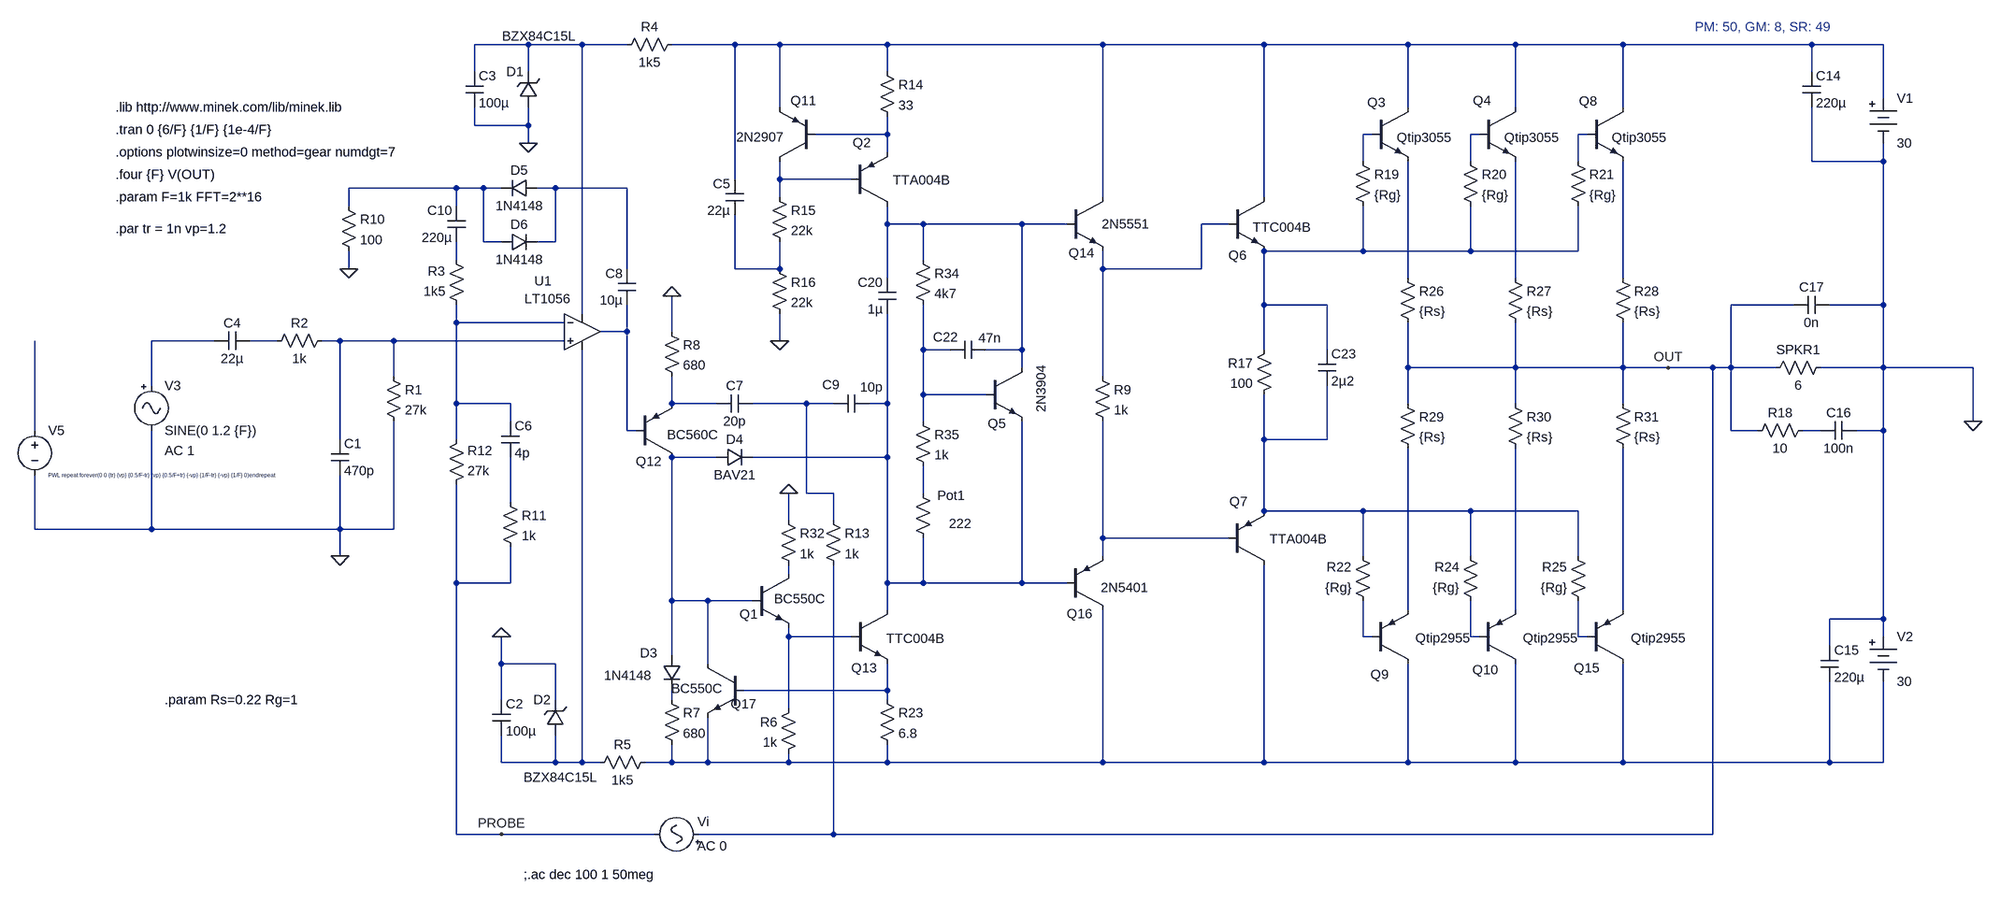
[diagram p0: schematic b44.3055.triple.5.steve.Jun11.asc]
b44.3055.triple.5.steve.Jun11.asc, the LTspice schematic file:
Version 4
SHEET 1 2228 840
WIRE -1952 -880 -2048 -880
WIRE -1856 -880 -1952 -880
WIRE -1776 -880 -1856 -880
WIRE -1584 -880 -1696 -880
WIRE -1504 -880 -1584 -880
WIRE -1312 -880 -1504 -880
WIRE -928 -880 -1312 -880
WIRE -640 -880 -928 -880
WIRE -384 -880 -640 -880
WIRE -192 -880 -384 -880
WIRE 0 -880 -192 -880
WIRE 336 -880 0 -880
WIRE 464 -880 336 -880
WIRE -2048 -832 -2048 -880
WIRE -1952 -832 -1952 -880
WIRE -1312 -832 -1312 -880
WIRE 336 -832 336 -880
WIRE 464 -784 464 -880
WIRE -1504 -768 -1504 -880
WIRE -384 -768 -384 -880
WIRE -192 -768 -192 -880
WIRE 0 -768 0 -880
WIRE -2048 -736 -2048 -768
WIRE -1952 -736 -1952 -768
WIRE -1952 -736 -2048 -736
WIRE -1312 -720 -1312 -752
WIRE -1312 -720 -1440 -720
WIRE -448 -720 -464 -720
WIRE -256 -720 -272 -720
WIRE -64 -720 -80 -720
WIRE -1952 -704 -1952 -736
WIRE -1312 -688 -1312 -720
WIRE -464 -672 -464 -720
WIRE -272 -672 -272 -720
WIRE -80 -672 -80 -720
WIRE 336 -672 336 -768
WIRE 464 -672 464 -704
WIRE 464 -672 336 -672
WIRE -1584 -640 -1584 -880
WIRE -1504 -640 -1504 -672
WIRE -1376 -640 -1504 -640
WIRE -2080 -624 -2272 -624
WIRE -2032 -624 -2080 -624
WIRE -2000 -624 -2032 -624
WIRE -1904 -624 -1936 -624
WIRE -1776 -624 -1904 -624
WIRE -1504 -608 -1504 -640
WIRE -928 -608 -928 -880
WIRE -640 -608 -640 -880
WIRE -2272 -592 -2272 -624
WIRE -2080 -592 -2080 -624
WIRE -1312 -560 -1312 -592
WIRE -1248 -560 -1312 -560
WIRE -1072 -560 -1248 -560
WIRE -992 -560 -1072 -560
WIRE -704 -560 -752 -560
WIRE -2032 -528 -2032 -624
WIRE -2000 -528 -2032 -528
WIRE -1904 -528 -1904 -624
WIRE -1904 -528 -1936 -528
WIRE -464 -512 -464 -592
WIRE -464 -512 -640 -512
WIRE -272 -512 -272 -592
WIRE -272 -512 -464 -512
WIRE -80 -512 -80 -592
WIRE -80 -512 -272 -512
WIRE -2080 -496 -2080 -528
WIRE -1248 -496 -1248 -560
WIRE -2272 -480 -2272 -512
WIRE -1776 -480 -1776 -624
WIRE -1584 -480 -1584 -576
WIRE -1504 -480 -1504 -528
WIRE -1504 -480 -1584 -480
WIRE -928 -480 -928 -512
WIRE -752 -480 -752 -560
WIRE -752 -480 -928 -480
WIRE -1312 -464 -1312 -560
WIRE -384 -464 -384 -672
WIRE -192 -464 -192 -672
WIRE 0 -464 0 -672
WIRE -640 -416 -640 -512
WIRE -528 -416 -640 -416
WIRE 304 -416 192 -416
WIRE 464 -416 464 -672
WIRE 464 -416 368 -416
WIRE -1856 -400 -1856 -880
WIRE -2080 -384 -2080 -416
WIRE -1888 -384 -2080 -384
WIRE -1776 -368 -1776 -416
WIRE -1776 -368 -1824 -368
WIRE -1696 -368 -1696 -432
WIRE -2512 -352 -2624 -352
WIRE -2400 -352 -2448 -352
WIRE -2288 -352 -2320 -352
WIRE -2192 -352 -2288 -352
WIRE -1888 -352 -2192 -352
WIRE -1504 -352 -1504 -400
WIRE -1248 -336 -1248 -416
WIRE -1200 -336 -1248 -336
WIRE -1072 -336 -1072 -560
WIRE -1072 -336 -1136 -336
WIRE -640 -336 -640 -416
WIRE -528 -336 -528 -416
WIRE -1072 -304 -1072 -336
WIRE -384 -304 -384 -384
WIRE -192 -304 -192 -384
WIRE -192 -304 -384 -304
WIRE 0 -304 0 -384
WIRE 0 -304 -192 -304
WIRE 80 -304 0 -304
WIRE 160 -304 80 -304
WIRE 192 -304 192 -416
WIRE 192 -304 160 -304
WIRE 272 -304 192 -304
WIRE 464 -304 464 -416
WIRE 464 -304 352 -304
WIRE 624 -304 464 -304
WIRE -2192 -288 -2192 -352
WIRE -928 -288 -928 -480
WIRE -2624 -272 -2624 -352
WIRE -1248 -256 -1248 -336
WIRE -1136 -256 -1248 -256
WIRE -2080 -240 -2080 -384
WIRE -1984 -240 -2080 -240
WIRE -1696 -240 -1696 -288
WIRE -1616 -240 -1696 -240
WIRE -1456 -240 -1552 -240
WIRE -1408 -240 -1456 -240
WIRE -1312 -240 -1312 -400
WIRE -1312 -240 -1344 -240
WIRE -384 -240 -384 -304
WIRE -192 -240 -192 -304
WIRE 0 -240 0 -304
WIRE -1984 -208 -1984 -240
WIRE -1248 -208 -1248 -256
WIRE 624 -208 624 -304
WIRE -2832 -192 -2832 -352
WIRE -1776 -192 -1776 -368
WIRE -1760 -192 -1776 -192
WIRE 192 -192 192 -304
WIRE 240 -192 192 -192
WIRE 352 -192 320 -192
WIRE 464 -192 464 -304
WIRE 464 -192 416 -192
WIRE -2288 -176 -2288 -352
WIRE -2080 -176 -2080 -240
WIRE -640 -176 -640 -256
WIRE -528 -176 -528 -272
WIRE -528 -176 -640 -176
WIRE -1616 -144 -1696 -144
WIRE -1312 -144 -1312 -240
WIRE -1312 -144 -1552 -144
WIRE -1456 -80 -1456 -240
WIRE -1408 -80 -1456 -80
WIRE -1248 -80 -1248 -128
WIRE -1984 -64 -1984 -144
WIRE -640 -48 -640 -176
WIRE -464 -48 -640 -48
WIRE -272 -48 -464 -48
WIRE -80 -48 -272 -48
WIRE -1488 -32 -1488 -80
WIRE -1408 -32 -1408 -80
WIRE -2832 -16 -2832 -112
WIRE -2624 -16 -2624 -192
WIRE -2624 -16 -2832 -16
WIRE -2288 -16 -2288 -112
WIRE -2288 -16 -2624 -16
WIRE -2192 -16 -2192 -208
WIRE -2192 -16 -2288 -16
WIRE -928 0 -928 -208
WIRE -704 0 -928 0
WIRE -2288 32 -2288 -16
WIRE -928 32 -928 0
WIRE -464 32 -464 -48
WIRE -272 32 -272 -48
WIRE -80 32 -80 -48
WIRE -1488 64 -1488 48
WIRE -2080 80 -2080 -96
WIRE -1984 80 -1984 16
WIRE -1984 80 -2080 80
WIRE -1312 80 -1312 -144
WIRE -1248 80 -1248 0
WIRE -1248 80 -1312 80
WIRE -1072 80 -1072 -208
WIRE -1072 80 -1248 80
WIRE -992 80 -1072 80
WIRE -1696 112 -1696 -144
WIRE -1632 112 -1696 112
WIRE -1552 112 -1632 112
WIRE -1312 128 -1312 80
WIRE -384 128 -384 -160
WIRE -192 128 -192 -160
WIRE 0 128 0 -160
WIRE 464 144 464 -192
WIRE 464 144 368 144
WIRE -1488 176 -1488 160
WIRE -1376 176 -1488 176
WIRE -464 176 -464 112
WIRE -448 176 -464 176
WIRE -272 176 -272 112
WIRE -256 176 -272 176
WIRE -80 176 -80 112
WIRE -64 176 -80 176
WIRE 464 176 464 144
WIRE 368 192 368 144
WIRE -1696 208 -1696 112
WIRE -2000 224 -2000 176
WIRE -1904 224 -2000 224
WIRE -1632 224 -1632 112
WIRE -1312 272 -1312 224
WIRE -1312 272 -1568 272
WIRE -2000 288 -2000 224
WIRE -1904 288 -1904 224
WIRE -1696 288 -1696 272
WIRE -1312 288 -1312 272
WIRE -1488 304 -1488 176
WIRE -2000 400 -2000 352
WIRE -1904 400 -1904 352
WIRE -1904 400 -2000 400
WIRE -1856 400 -1856 -336
WIRE -1856 400 -1904 400
WIRE -1824 400 -1856 400
WIRE -1696 400 -1696 368
WIRE -1696 400 -1744 400
WIRE -1632 400 -1632 320
WIRE -1632 400 -1696 400
WIRE -1488 400 -1488 384
WIRE -1488 400 -1632 400
WIRE -1312 400 -1312 368
WIRE -1312 400 -1488 400
WIRE -928 400 -928 128
WIRE -928 400 -1312 400
WIRE -640 400 -640 48
WIRE -640 400 -928 400
WIRE -384 400 -384 224
WIRE -384 400 -640 400
WIRE -192 400 -192 224
WIRE -192 400 -384 400
WIRE 0 400 0 224
WIRE 0 400 -192 400
WIRE 368 400 368 256
WIRE 368 400 0 400
WIRE 464 400 464 256
WIRE 464 400 368 400
WIRE -2080 528 -2080 80
WIRE -2000 528 -2080 528
WIRE -1728 528 -2000 528
WIRE -1408 528 -1408 48
WIRE -1408 528 -1648 528
WIRE 160 528 160 -304
WIRE 160 528 -1408 528
FLAG 624 -208 0
FLAG 80 -304 OUT
FLAG -2000 528 PROBE
FLAG -2288 32 0
FLAG -2000 176 0
FLAG -1952 -704 0
FLAG -1696 -432 0
FLAG -1504 -352 0
FLAG -1488 -80 0
FLAG -2272 -480 0
SYMBOL res -624 -352 M0
SYMATTR InstName R17
SYMATTR Value 100
SYMATTR SpiceLine pwr=0.5
SYMBOL Misc\\battery 464 -800 R0
WINDOW 123 0 0 Left 2
WINDOW 39 0 0 Left 2
SYMATTR InstName V1
SYMATTR Value 30
SYMBOL Misc\\battery 464 160 R0
WINDOW 123 0 0 Left 2
WINDOW 39 0 0 Left 2
SYMATTR InstName V2
SYMATTR Value 30
SYMBOL res 368 -320 R90
WINDOW 0 0 56 VBottom 2
WINDOW 3 32 56 VTop 2
SYMATTR InstName SPKR1
SYMATTR Value 6
SYMBOL cap 320 -832 R0
SYMATTR InstName C14
SYMATTR Value 220µ
SYMATTR SpiceLine V=63
SYMBOL cap 352 192 R0
SYMATTR InstName C15
SYMATTR Value 220µ
SYMATTR SpiceLine V=63
SYMBOL res 224 -176 R270
WINDOW 0 32 56 VTop 2
WINDOW 3 0 56 VBottom 2
SYMATTR InstName R18
SYMATTR Value 10
SYMATTR SpiceLine pwr=2
SYMBOL cap 352 -176 R270
WINDOW 0 32 32 VTop 2
WINDOW 3 0 32 VBottom 2
SYMATTR InstName C16
SYMATTR Value 100n
SYMATTR SpiceLine V=200
SYMBOL res -480 -688 R0
SYMATTR InstName R19
SYMATTR Value {Rg}
SYMBOL res -288 -688 R0
SYMATTR InstName R20
SYMATTR Value {Rg}
SYMBOL res -96 -688 R0
SYMATTR InstName R21
SYMATTR Value {Rg}
SYMBOL res -448 128 R180
WINDOW 0 36 76 Left 2
WINDOW 3 36 40 Left 2
SYMATTR InstName R22
SYMATTR Value {Rg}
SYMBOL res -256 128 R180
WINDOW 0 36 76 Left 2
WINDOW 3 36 40 Left 2
SYMATTR InstName R24
SYMATTR Value {Rg}
SYMBOL res -64 128 R180
WINDOW 0 36 76 Left 2
WINDOW 3 36 40 Left 2
SYMATTR InstName R25
SYMATTR Value {Rg}
SYMBOL res -400 -480 R0
SYMATTR InstName R26
SYMATTR Value {Rs}
SYMATTR SpiceLine pwr=2
SYMBOL res -208 -480 R0
SYMATTR InstName R27
SYMATTR Value {Rs}
SYMATTR SpiceLine pwr=2
SYMBOL res -16 -480 R0
SYMATTR InstName R28
SYMATTR Value {Rs}
SYMATTR SpiceLine pwr=2
SYMBOL cap 304 -400 R270
WINDOW 0 32 32 VTop 2
WINDOW 3 0 32 VBottom 2
SYMATTR InstName C17
SYMATTR Value 0n
SYMBOL res -400 -256 R0
SYMATTR InstName R29
SYMATTR Value {Rs}
SYMATTR SpiceLine pwr=2
SYMBOL res -208 -256 R0
SYMATTR InstName R30
SYMATTR Value {Rs}
SYMATTR SpiceLine pwr=2
SYMBOL res -16 -256 R0
SYMATTR InstName R31
SYMATTR Value {Rs}
SYMATTR SpiceLine pwr=2
SYMBOL Misc\\signal -1632 528 M270
WINDOW 123 -21 19 VLeft 2
WINDOW 3 24 104 Invisible 2
WINDOW 0 22 18 VLeft 2
WINDOW 39 0 0 Left 0
SYMATTR Value2 AC 0
SYMATTR Value 0
SYMATTR InstName Vi
SYMBOL res -1264 -512 R0
SYMATTR InstName R34
SYMATTR Value 4k7
SYMBOL res -1264 -96 R0
WINDOW 0 41 20 Left 2
WINDOW 3 62 70 Left 2
SYMATTR InstName Pot1
SYMATTR Value 222
SYMBOL res -1264 -224 R0
SYMATTR InstName R35
SYMATTR Value 1k
SYMBOL npn -1136 -304 R0
WINDOW 0 3 100 Left 2
WINDOW 3 99 -4 VRight 2
SYMATTR InstName Q5
SYMATTR Value 2N3904
SYMBOL npn -704 -608 R0
WINDOW 0 0 104 Left 2
WINDOW 3 44 54 Left 2
SYMATTR InstName Q6
SYMATTR Value TTC004B
SYMBOL pnp -704 48 M180
WINDOW 0 2 113 Left 2
WINDOW 3 176 46 Right 2
SYMATTR InstName Q7
SYMATTR Value TTA004B
SYMBOL cap -1200 -320 R270
WINDOW 0 23 -8 VTop 2
WINDOW 3 52 71 VBottom 2
SYMATTR InstName C22
SYMATTR Value 47n
SYMBOL cap -544 -336 R0
SYMATTR InstName C23
SYMATTR Value 2µ2
SYMATTR SpiceLine V=100
SYMBOL cap -1296 -464 M0
SYMATTR InstName C20
SYMATTR Value 1µ
SYMATTR SpiceLine V=100
SYMBOL npn -448 -768 R0
WINDOW 0 -8 -9 Left 2
WINDOW 3 44 54 Left 2
SYMATTR InstName Q3
SYMATTR Value Qtip3055
SYMBOL npn -256 -768 R0
WINDOW 0 -12 -12 Left 2
WINDOW 3 44 54 Left 2
SYMATTR InstName Q4
SYMATTR Value Qtip3055
SYMBOL npn -64 -768 R0
WINDOW 0 -15 -11 Left 2
WINDOW 3 44 54 Left 2
SYMATTR InstName Q8
SYMATTR Value Qtip3055
SYMBOL pnp -448 224 M180
WINDOW 0 -2 -19 Left 2
WINDOW 3 176 46 Right 2
SYMATTR InstName Q9
SYMATTR Value Qtip2955
SYMBOL pnp -256 224 M180
WINDOW 0 -13 -11 Left 2
WINDOW 3 176 46 Right 2
SYMATTR InstName Q10
SYMATTR Value Qtip2955
SYMBOL pnp -64 224 M180
WINDOW 0 -24 -8 Left 2
WINDOW 3 176 46 Right 2
SYMATTR InstName Q15
SYMATTR Value Qtip2955
SYMBOL res -2208 -304 R0
SYMATTR InstName R1
SYMATTR Value 27k
SYMBOL cap -2304 -176 R0
SYMATTR InstName C1
SYMATTR Value 470p
SYMBOL res -2304 -368 R90
WINDOW 0 0 56 VBottom 2
WINDOW 3 32 56 VTop 2
SYMATTR InstName R2
SYMATTR Value 1k
SYMBOL Misc\\signal -2624 -288 R0
WINDOW 123 24 132 Left 2
WINDOW 39 0 0 Left 0
SYMATTR Value2 AC 1
SYMATTR InstName V3
SYMATTR Value SINE(0 1.2 {F})
SYMBOL Opamps\\LT1056 -1856 -432 R0
WINDOW 0 -85 -26 Left 2
WINDOW 3 -103 5 Left 2
SYMATTR InstName U1
SYMBOL res -2064 -400 R180
WINDOW 0 36 76 Left 2
WINDOW 3 36 40 Left 2
SYMATTR InstName R3
SYMATTR Value 1k5
SYMBOL res -1680 -896 R90
WINDOW 0 0 56 VBottom 2
WINDOW 3 32 56 VTop 2
SYMATTR InstName R4
SYMATTR Value 1k5
SYMATTR SpiceLine pwr=0.5
SYMBOL res -1728 384 R90
WINDOW 0 0 56 VBottom 2
WINDOW 3 32 56 VTop 2
SYMATTR InstName R5
SYMATTR Value 1k5
SYMATTR SpiceLine pwr=0.5
SYMBOL cap -2016 288 R0
SYMATTR InstName C2
SYMATTR Value 100µ
SYMATTR SpiceLine V=25
SYMBOL cap -2064 -832 R0
SYMATTR InstName C3
SYMATTR Value 100µ
SYMATTR SpiceLine V=25
SYMBOL zener -1936 -768 R180
WINDOW 0 24 64 Left 2
WINDOW 3 -69 127 Left 2
SYMATTR InstName D1
SYMATTR Value BZX84C15L
SYMATTR Description Diode
SYMATTR Type diode
SYMBOL zener -1888 352 R180
WINDOW 0 24 64 Left 2
WINDOW 3 -59 -75 Left 2
SYMATTR InstName D2
SYMATTR Value BZX84C15L
SYMATTR Description Diode
SYMATTR Type diode
SYMBOL res -1472 288 M0
SYMATTR InstName R6
SYMATTR Value 1k
SYMBOL res -1712 272 R0
SYMATTR InstName R7
SYMATTR Value 680
SYMBOL npn -1552 64 R0
WINDOW 0 -23 72 Left 2
WINDOW 3 38 44 Left 2
SYMATTR InstName Q1
SYMATTR Value BC550C
SYMBOL cap -2448 -368 R90
WINDOW 0 0 32 VBottom 2
WINDOW 3 32 32 VTop 2
SYMATTR InstName C4
SYMATTR Value 22µ
SYMBOL res -1712 -384 R0
SYMATTR InstName R8
SYMATTR Value 680
SYMBOL diode -1712 208 R0
WINDOW 0 -41 -3 Left 2
WINDOW 3 -105 37 Left 2
SYMATTR InstName D3
SYMATTR Value 1N4148
SYMBOL res -2096 -80 M180
WINDOW 0 36 76 Left 2
WINDOW 3 36 40 Left 2
SYMATTR InstName R12
SYMATTR Value 27k
SYMBOL res -1424 -48 R0
SYMATTR InstName R13
SYMATTR Value 1k
SYMBOL pnp -1440 -672 R180
WINDOW 0 -1 108 Left 2
WINDOW 3 141 43 Right 2
SYMATTR InstName Q11
SYMATTR Value 2N2907
SYMBOL res -1328 -848 R0
SYMATTR InstName R14
SYMATTR Value 33
SYMBOL res -1520 -624 R0
SYMATTR InstName R15
SYMATTR Value 22k
SYMBOL res -1520 -496 R0
SYMATTR InstName R16
SYMATTR Value 22k
SYMBOL cap -1568 -640 M0
SYMATTR InstName C5
SYMATTR Value 22µ
SYMATTR SpiceLine V=25
SYMBOL cap -2000 -144 M180
WINDOW 0 24 56 Left 2
WINDOW 3 24 8 Left 2
SYMATTR InstName C6
SYMATTR Value 4p
SYMBOL pnp -1760 -144 M180
WINDOW 0 0 -7 Left 2
WINDOW 3 146 40 Right 2
SYMATTR InstName Q12
SYMATTR Value BC560C
SYMBOL res -1328 272 R0
SYMATTR InstName R23
SYMATTR Value 6.8
SYMBOL cap -1552 -256 R90
WINDOW 0 0 32 VBottom 2
WINDOW 3 32 32 VTop 2
SYMATTR InstName C7
SYMATTR Value 20p
SYMBOL cap -1344 -256 R90
WINDOW 0 -2 68 VBottom 2
WINDOW 3 -29 -4 VTop 2
SYMATTR InstName C9
SYMATTR Value 10p
SYMBOL diode -1616 -128 R270
WINDOW 0 32 32 VTop 2
WINDOW 3 0 32 VBottom 2
SYMATTR InstName D4
SYMATTR Value BAV21
SYMBOL cap -2064 -528 R180
WINDOW 0 24 56 Left 2
WINDOW 3 24 8 Left 2
SYMATTR InstName C10
SYMATTR Value 220µ
SYMBOL pnp -1376 -592 M180
WINDOW 0 2 113 Left 2
WINDOW 3 176 46 Right 2
SYMATTR InstName Q2
SYMATTR Value TTA004B
SYMBOL npn -1376 128 R0
WINDOW 0 0 104 Left 2
WINDOW 3 62 51 Left 2
SYMATTR InstName Q13
SYMATTR Value TTC004B
SYMBOL npn -992 -608 R0
WINDOW 0 3 100 Left 2
WINDOW 3 147 48 Right 2
SYMATTR InstName Q14
SYMATTR Value 2N5551
SYMBOL pnp -992 128 M180
WINDOW 0 0 -7 Left 2
WINDOW 3 146 40 Right 2
SYMATTR InstName Q16
SYMATTR Value 2N5401
SYMBOL res -944 -304 R0
SYMATTR InstName R9
SYMATTR Value 1k
SYMBOL diode -1936 -640 R90
WINDOW 0 0 32 VBottom 2
WINDOW 3 32 32 VTop 2
SYMATTR InstName D5
SYMATTR Value 1N4148
SYMBOL diode -2000 -512 R270
WINDOW 0 32 32 VTop 2
WINDOW 3 0 32 VBottom 2
SYMATTR InstName D6
SYMATTR Value 1N4148
SYMBOL cap -1760 -416 R180
WINDOW 0 24 56 Left 2
WINDOW 3 24 8 Left 2
SYMATTR InstName C8
SYMATTR Value 10µ
SYMBOL res -2288 -608 R0
SYMATTR InstName R10
SYMATTR Value 100
SYMBOL npn -1568 224 M0
WINDOW 0 -23 72 Left 2
WINDOW 3 38 44 Left 2
SYMATTR InstName Q17
SYMATTR Value BC550C
SYMBOL res -2000 -80 R0
SYMATTR InstName R11
SYMATTR Value 1k
SYMBOL voltage -2832 -208 R0
WINDOW 3 24 96 Left 0
SYMATTR Value PWL repeat forever(0 0 {tr} {vp} {0.5/F-tr} {vp} {0.5/F+tr} {-vp} {1/F-tr} {-vp} {1/F} 0)endrepeat
SYMATTR InstName V5
SYMBOL res -1504 -48 R0
SYMATTR InstName R32
SYMATTR Value 1k
TEXT -1960 600 Left 2 !;.ac dec 100 1 50meg
TEXT -2688 -768 Left 2 !.lib http://www.minek.com/lib/minek.lib
TEXT -2688 -728 Left 2 !.tran 0 {6/F} {1/F} {1e-4/F}
TEXT -2688 -688 Left 2 !.options plotwinsize=0 method=gear numdgt=7
TEXT -2688 -648 Left 2 !.four {F} V(OUT)
TEXT -2688 -608 Left 2 !.param F=1k FFT=2**16
TEXT -2600 288 Left 2 !.param Rs=0.22 Rg=1
TEXT 128 -912 Left 2 ;PM: 50, GM: 8, SR: 49
TEXT -2688 -552 Left 2 !.par tr = 1n vp=1.2

The netlist it stands for:
* b44.3055.triple.5.steve.Jun11.asc
R17 N012 N029 100 pwr=0.5
V1 N002 0 30
V2 0 N045 30
R§SPKR1 0 OUT 6
C14 N002 0 220µ V=63
C15 0 N045 220µ V=63
R18 OUT N028 10 pwr=2
C16 N028 0 100n V=200
R19 N004 N012 {Rg}
R20 N005 N012 {Rg}
R21 N006 N012 {Rg}
R22 N039 N029 {Rg}
R24 N040 N029 {Rg}
R25 N041 N029 {Rg}
R26 N015 OUT {Rs} pwr=2
R27 N016 OUT {Rs} pwr=2
R28 N017 OUT {Rs} pwr=2
C17 OUT 0 0n
R29 OUT N035 {Rs} pwr=2
R30 OUT N036 {Rs} pwr=2
R31 OUT N037 {Rs} pwr=2
Vi OUT PROBE 0 AC 0
R34 N010 N023 4k7
R§Pot1 N031 N026 222
R35 N023 N031 1k
Q5 N010 N023 N026 0 2N3904
Q6 N002 N011 N012 0 TTC004B
Q7 N045 N033 N029 0 TTA004B
C22 N023 N010 47n
C23 N012 N029 2µ2 V=100
C20 N010 N026 1µ V=100
Q3 N002 N004 N015 0 Qtip3055
Q4 N002 N005 N016 0 Qtip3055
Q8 N002 N006 N017 0 Qtip3055
Q9 N045 N039 N035 0 Qtip2955
Q10 N045 N040 N036 0 Qtip2955
Q15 N045 N041 N037 0 Qtip2955
R1 N022 0 27k
C1 N022 0 470p
R2 N022 N021 1k
V3 N020 0 SINE(0 1.2 {F}) AC 1
XU1 N022 N018 N001 N044 N019 LT1056  ; pins In+ In- V+ V- OUT
R3 N018 N013 1k5
R4 N002 N001 1k5 pwr=0.5
R5 N045 N044 1k5 pwr=0.5
C2 0 N044 100µ V=25
C3 N001 0 100µ V=25
D1 0 N001 BZX84C15L
D2 N044 0 BZX84C15L
R6 N038 N045 1k
R7 N043 N045 680
Q1 N034 N030 N038 0 BC550C
C4 N021 N020 22µ
R8 0 N024 680
D3 N030 N043 1N4148
R12 PROBE N018 27k
R13 N025 OUT 1k
Q11 N007 N003 N002 0 2N2907
R14 N002 N003 33
R15 N007 N014 22k
R16 N014 0 22k
C5 N002 N014 22µ V=25
C6 N032 N018 4p
Q12 N030 N019 N024 0 BC560C
R23 N042 N045 6.8
C7 N025 N024 20p
C9 N026 N025 10p
D4 N030 N026 BAV21
C10 N013 N008 220µ
Q2 N010 N007 N003 0 TTA004B
Q13 N026 N038 N042 0 TTC004B
Q14 N002 N010 N011 0 2N5551
Q16 N045 N026 N033 0 2N5401
R9 N011 N033 1k
D5 N009 N008 1N4148
D6 N008 N009 1N4148
C8 N019 N009 10µ
R10 N008 0 100
Q17 N030 N042 N045 0 BC550C
R11 N032 PROBE 1k
V5 N027 0 PWL repeat forever(0 0 {tr} {vp} {0.5/F-tr} {vp} {0.5/F+tr} {-vp} {1/F-tr} {-vp} {1/F} 0)endrepeat
R32 0 N034 1k
.model D D
.lib standard.dio
.model NPN NPN
.model PNP PNP
.lib standard.bjt
;.ac dec 100 1 50meg
.lib http://www.minek.com/lib/minek.lib
.tran 0 {6/F} {1/F} {1e-4/F}
.options plotwinsize=0 method=gear numdgt=7
.four {F} V(OUT)
.param F=1k FFT=2**16
.param Rs=0.22 Rg=1
* PM: 50, GM: 8, SR: 49
.par tr = 1n vp=1.2
.backanno
.end